# Altium project MS1-SEQ.PrjPcb (part 2 of 3)

## Sheet PowerSheet.SchDoc: MS1-SEQ
size A; Author: Paul Miailhe; CompanyName: Mines Space; SheetNumber: 5; SheetTotal: 6
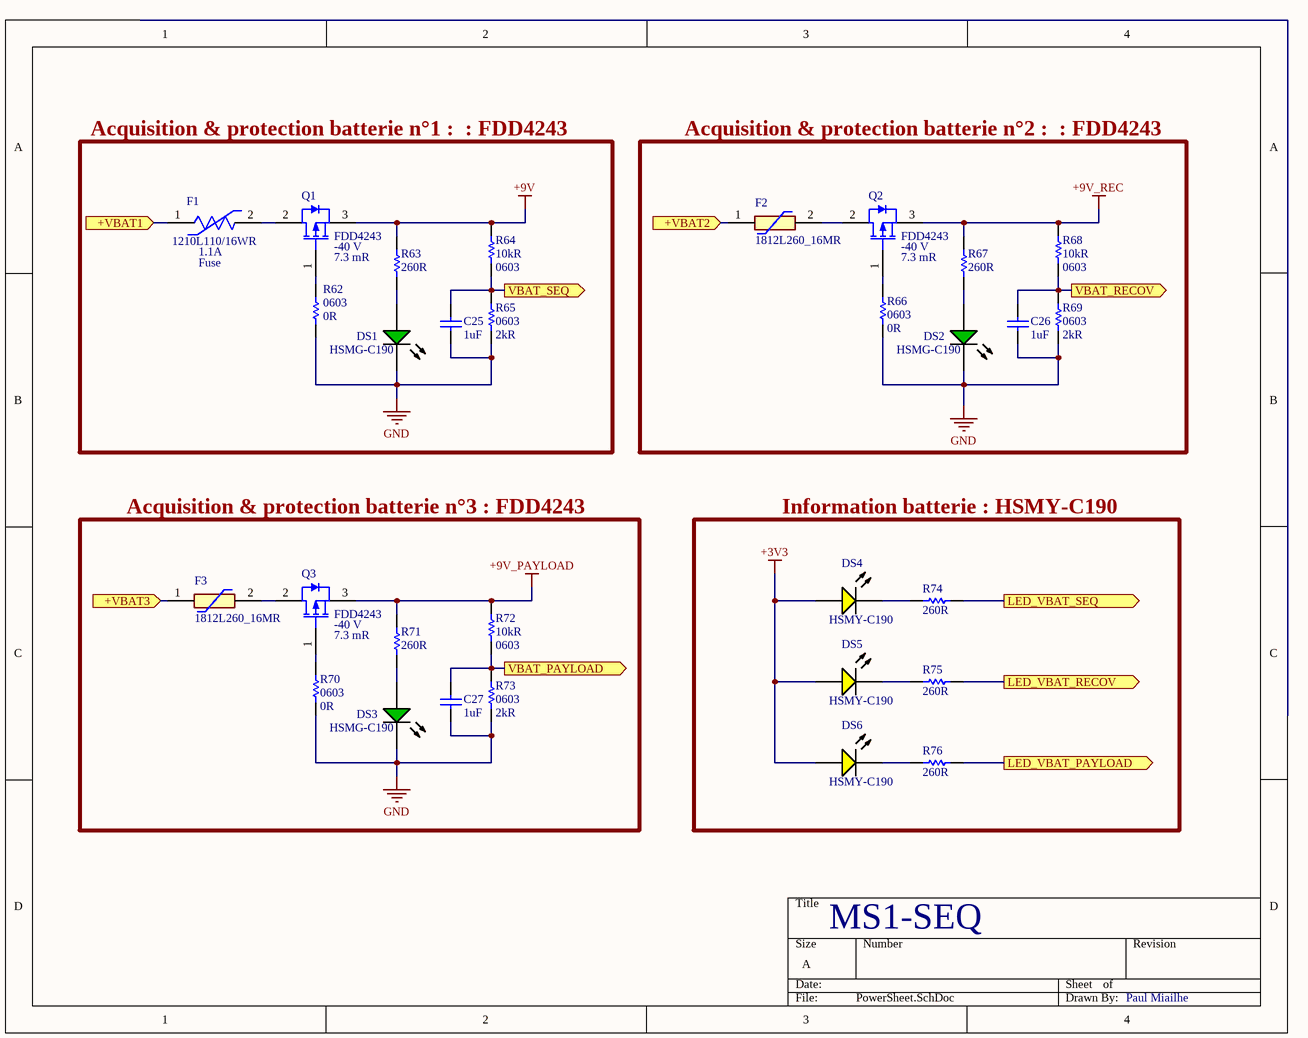
[diagram p2: PowerSheet.SchDoc]

### Parts
C25  Capacitance: 1uF  [CAPC1608X90X35LL10T15]  (hidden comment: GRM188R61E105KA12D)
C26  Capacitance: 1uF  [CAPC1608X90X35LL10T15]  (hidden comment: GRM188R61E105KA12D)
C27  Capacitance: 1uF  [CAPC1608X90X35LL10T15]  (hidden comment: GRM188R61E105KA12D)
DS1  HSMG-C190  [AVAG-HSMX-C190_V]
DS2  HSMG-C190  [AVAG-HSMX-C190_V]
DS3  HSMG-C190  [AVAG-HSMX-C190_V]
DS4  HSMY-C190  [AVAG-HSMX-C190_V]
DS5  HSMY-C190  [AVAG-HSMX-C190_V]
DS6  HSMY-C190  [AVAG-HSMX-C190_V]
F1  1210L110/16WR  Hold Current: 1.1A  Category: Fuse  [FP-1210L110-16WR-MFG]
F2  1812L260_16MR  [1812L010DR]
F3  1812L260_16MR  [1812L010DR]
Q1  FDD4243  VDS (max): -40 V  RDS (on) (max) (@10V): 7.3 mR  [INF-PG-TO252-3-313_L]
Q2  FDD4243  VDS (max): -40 V  RDS (on) (max) (@10V): 7.3 mR  [INF-PG-TO252-3-313_L]
Q3  FDD4243  VDS (max): -40 V  RDS (on) (max) (@10V): 7.3 mR  [INF-PG-TO252-3-313_L]
R62  Package Reference: 0603  Resistance: 0R  [RESC1608X55X25ML10T15]  (hidden comment: RC0603JR-070RL)
R63  260R  [RESC1609X50X30NL8T20]  (no BOM)
R64  Resistance: 10kR  Case Code (Imperial): 0603  [RESC1609X55X30LL15T15]  (hidden comment: ERJ3EKF1002V)
R65  Case Code (Imperial): 0603  Resistance: 2kR  [RESC1608X55X30ML15T15]  (hidden comment: ERJ-3EKF2001V)
R66  Case Code (Imperial): 0603  Resistance: 0R  [RESC1608X55X25ML10T15]  (hidden comment: RC0603JR-070RL)
R67  260R  [RESC1609X50X30NL8T20]  (no BOM)
R68  Resistance: 10kR  Case Code (Imperial): 0603  [RESC1609X55X30LL15T15]  (hidden comment: ERJ3EKF1002V)
R69  Case Code (Imperial): 0603  Resistance: 2kR  [RESC1608X55X30ML15T15]  (hidden comment: ERJ-3EKF2001V)
R70  Case Code (Imperial): 0603  Resistance: 0R  [RESC1608X55X25ML10T15]  (hidden comment: RC0603JR-070RL)
R71  260R  [RESC1609X50X30NL8T20]  (no BOM)
R72  Resistance: 10kR  Case Code (Imperial): 0603  [RESC1609X55X30LL15T15]  (hidden comment: ERJ3EKF1002V)
R73  Case Code (Imperial): 0603  Resistance: 2kR  [RESC1608X55X30ML15T15]  (hidden comment: ERJ-3EKF2001V)
R74  260R  [RESC1609X50X30NL8T20]  (no BOM)
R75  260R  [RESC1609X50X30NL8T20]  (no BOM)
R76  260R  [RESC1609X50X30NL8T20]  (no BOM)

### Blocks framed on the sheet
Acquisition & protection batterie n°1 :  : FDD4243: C25 DS1 F1 Q1 R62-R65
Acquisition & protection batterie n°2 :  : FDD4243: C26 DS2 F2 Q2 R66-R69
Acquisition & protection batterie n°3 : FDD4243: C27 DS3 F3 Q3 R70-R73
Information batterie : HSMY-C190: DS4-DS6 R74-R76

### Ports
+VBAT1 (in), +VBAT2 (in), +VBAT3 (in), LED_VBAT_PAYLOAD (out), LED_VBAT_RECOV (out), LED_VBAT_SEQ (out), VBAT_PAYLOAD (out), VBAT_RECOV (out), VBAT_SEQ (out)

### Nets
+3V3: DS4.1(A) DS5.1(A) DS6.1(A)
+9V: Q1.3(SOURCE) R63.1 R64.2
+9V_PAYLOAD: Q3.3(SOURCE) R71.1 R72.2
+9V_REC: Q2.3(SOURCE) R67.1 R68.2
GND: C25.1 C26.1 C27.1 DS1.2(K) DS2.2(K) DS3.2(K) R62.1 R65.1 R66.1 R69.1 R70.1 R73.1
NetC25_2: C25.2 R64.1 R65.2 ; port VBAT_SEQ
NetC26_2: C26.2 R68.1 R69.2 ; port VBAT_RECOV
NetC27_2: C27.2 R72.1 R73.2 ; port VBAT_PAYLOAD
NetDS1_1: DS1.1(A) R63.2
NetDS2_1: DS2.1(A) R67.2
NetDS3_1: DS3.1(A) R71.2
NetDS4_2: DS4.2(K) R74.1
NetDS5_2: DS5.2(K) R75.1
NetDS6_2: DS6.2(K) R76.1
NetF1_1: F1.1 ; port +VBAT1
NetF1_2: F1.2 Q1.2(DRAIN)
NetF2_1: F2.1 ; port +VBAT2
NetF2_2: F2.2 Q2.2(DRAIN)
NetF3_1: F3.1 ; port +VBAT3
NetF3_2: F3.2 Q3.2(DRAIN)
NetJ101_35: R75.2 ; port LED_VBAT_RECOV
NetJ101_36: R74.2 ; port LED_VBAT_SEQ
NetJ101_37: R76.2 ; port LED_VBAT_PAYLOAD
NetQ1_1: Q1.1(GATE) R62.2
NetQ2_1: Q2.1(GATE) R66.2
NetQ3_1: Q3.1(GATE) R70.2

### Notes on the sheet
- MS1-SEQ
- Paul Miailhe

### Library data of the parts
C25-C27 = CMP-2006-02459-1: Manufacturer: Murata; Material: Ceramic; Tolerance: 10%; Voltage Rating: 25V; Dielectric: X5R; Part Number: GRM188R61E105KA12D; Supplier 1: Farnell; Supplier Part Number 1: 1828802; Manufacturer Part Number: GRM188R61E105KA12D; RoHS: Yes; Category: Ceramic Capacitors; Pricing 1: 10=0.13400, 100=0.05920, 500=0.03800, 1000=0.03090 (GBP); Mount: Surface Mount; Case/Package: 0603; Number of Pins: 2; Case Code (Metric): 1608; Case Code (Imperial): 0603; Min Operating Temperature: -55°C; Max Operating Temperature: 85°C; Packaging: Tape and Reel; Package Quantity: 4000; Voltage Rating (DC): 25V; Termination: SMD/SMT; Voltage: 25V; Length: 1.6mm; Width: 0.031inch; Height: 0.8mm; Depth: 0.8mm; Thickness: 0.035inch; Radiation Hardening: No; RoHS Compliant: Yes; REACH SVHC: No SVHC; Lead Free: Lead Free
DS1-DS3 = CMP-1744-00002-1: Chip LED, Green, 2.2 V, -40 to 85 degC, 2-Pin SMD, RoHS, Tape and Reel; Frequency: 400 KHz; Max Supply Voltage: 5.5 V; Access Time: 3500 ns; Clock Frequency: 100 KHz; Case\Package: SOIC; Density: 32 kb; Nominal Supply Current: 2 mA; Interface: Serial; Min Supply Voltage: 1.7 V; Packaging: Tape and Reel; PackageReference: HSMX-C190; ComponentLink2URL: http://docs.avagotech.com/docs/AV02-0551EN; RoHSCompliant: true; Pins: 8; REACH SVHC: No SVHC; Max Operating Temperature: 85 degC; Width: 4 mm; Radiation Hardening: No; Package Quantity: 3000; ComponentLink3Description: Package Specification; ComponentLink1Description: Manufacturer URL; Min Operating Temperature: -40 degC; PackageDescription: 2-Pin Surface Mount Device, Body 1.6 x 0.8 mm, Height 0.9 mm; Max Clock Frequency: 100 KHz; Height: 1.5 mm; ComponentLink1URL: http://www.avagotech.com/; DatasheetVersion: Mar-12; ComponentLink2Description: Datasheet; Mount: Surface Mount; Length: 5 mm; ComponentLink3URL: http://www.fairchildsemi.com/dwg/MA/MA03D.pdf
DS4-DS6 = CMP-1744-00003-1: LED Uni-Color Yellow, 65 mW, 20 mA, -40 to 85 degC, 2-Pin SMD, RoHS, Tape and Reel; Tolerance: 1%; Voltage Rating: 50 V; Power Rating: 100 mW; Case\Package: 0603; Resistance: 390 Ohm; Min Operating Temperature: -55 degC; Length: 1.6 mm; ComponentLink3Description: Package Specification; Mount: Surface Mount; PackageReference: HSMX-C190; ComponentLink2Description: Datasheet; DatasheetVersion: Mar-12; Case Code (Metric): 1608; Pins: 2; Package Quantity: 5000; ComponentLink2URL: http://docs.avagotech.com/docs/AV02-0551EN; ComponentLink1Description: Manufacturer URL; RoHSCompliant: true; Packaging: Tape and Reel; PackageDescription: 2-Pin Surface Mount Device, Body 1.6 x 0.8 mm, Height 0.9 mm; REACH SVHC: No SVHC; ComponentLink3URL: http://www.fairchildsemi.com/dwg/MA/MA03D.pdf; Voltage Rating (DC): 50 V; Width: 0.8 mm; ComponentLink1URL: http://www.avagotech.com/; Max Operating Temperature: 155 degC; Case Code (Imperial): 0603; Height: 0.45 mm
F1 = CMP-08606-000029-1: PTC RESET FUSE 16V 1.1A 1210; Manufacturer: Littelfuse Inc; Trip Time: 0.1s; Value: 0.06-0.21Ω; Trip Current: 2.2A; Current Rating: 100A; Ambient Temperature Range Low: -40°C; Voltage Rating: 16V; ComponentLink2URL: https://www.littelfuse.com/~/media/electronics/datasheets/resettable_ptcs/littelfuse_ptc_1210l_datasheet.pdf.pdf; Device Class L2: PTC Resettable Fuses; Automotive: No; Temperature: -40°C to +85°C; Mouser Description: Resettable Fuses - PPTC 16V 1.10A 1210 PTC; Temperature Range High: +85°C; Manufacturer Part Number: 1210L110/16WR; Temperature Range Low: -40°C; Device Class L1: Circuit Protection; Octopart: https://octopart.com/1210l110%2F16wr-littelfuse-28867107; Lead Free: Yes; Resistance: 0.06-0.21Ω; RoHS: TRUE; Digikey Description: PTC RESET FUSE 16V 1.1A 1210; Package: 0; Height: 1.25mm; Device Class L3: unset; ComponentLink2Description: Datasheet; Ambient Temperature Range High: +85°C
F2 F3 = 1812L260_16MR: Resettable Fuse; Manufacturer_Name: LITTELFUSE; Manufacturer_Part_Number: 1812L260/16MR; Datasheet Link: http://www.littelfuse.com/~/media/electronics/datasheets/resettable_ptcs/littelfuse_ptc_1812l_datasheet.pdf.pdf; Height: 1.25mm; Mouser Part Number: 576-1812L260/16MR; Mouser Price/Stock: https://www.mouser.co.uk/ProductDetail/Littelfuse/1812L260-16MR?qs=cIziFXvMxOVeszNO%252BSt%252B3Q%3D%3D; Arrow Part Number: 1812L260/16MR; Arrow Price/Stock: https://www.arrow.com/en/products/1812l26016mr/littelfuse
Q1-Q3 = CMP-1138-00157-1: OptiMOS-P2 Power-Transistor, -40 V VDS, -85 A ID, PG-TO252-3-313, Reel, Green; PartNumber: IPD85P04P4-07; Manufacturer: Infineon; Ptot (max): 88 W; RthJC (max): 1.7 K/W; VGS(th) (max): -4 V; IDpuls (max): -340 A; VGS(th) (min): -2 V; ID (max): -85 A; QG: 69 nC; Green: TRUE; Mounting Technology: Surface Mount; Technology: OptiMOS-P2; ComponentLink1URL: http://www.infineon.com/; DatasheetVersion: Rev. 1.0; PackageReference: PG-TO252-3-313; ComponentLink2Description: Datasheet; ComponentLink2URL: http://www.infineon.com/dgdl/IPD85P04P4-07_DS_10.pdf?folderId=db3a304412b407950112b42b75b74520&fileId=db3a30432f69f146012f782666e92ddd&location=en.Products.Automotive_ICs.Automotive_MOSFETs.Single__P-Channel_40V_MOSFETs.DATASHEET.IPD85P04P4-07_DS_10.pdf; Halogen-free: TRUE; ComponentLink3Description: Package Specification; Packing: Reel; PackageVersion: Oct-10; PackageDescription: 3-Pin Plastic (Green) Transistor Single Outline Package, 6.5 x 6.12 mm Body, 2.28 mm Pitch; ComponentLink3URL: http://www.infineon.com/dgdl/PG-TO252-3-313-Package_Overview.pdf?folderId=db3a30432b57a660012b81890ade72d2&fileId=db3a30432b57a660012b8193af2872eb; ComponentLink1Description: Manufacturer URL
R62 R66 R70 = CMP-2100-03667-1: Chip Resistor, 0 Ohm, +/- 5%, 0.1 W, -55 to 155 degC, 0603 (1608 Metric), RoHS, Tape and Reel; Manufacturer: Yageo; Temperature Coefficient: 200ppm/degreesC; Voltage Rating: 50V; Power Rating: 100mW; Width: 0.8mm; Max Operating Temperature: 155degC; Tolerance: 5%; Height: 0.45mm; Depth: 0.8mm; Package Description: 2-Pin Surface Mount Device, Body 1.6 x 0.8 mm; Termination: SMD/SMT; Package Quantity: 5000; Case/Package: 0603; Radiation Hardening: No; Number of Pins: 2; Length: 1.6mm; Lead Free: LeadFree; Voltage Rating (DC): 50V; Military Standard: Not; Datasheet URL: http://www.yageo.com/NewPortal/yageodocoutput?fileName=/pdf/R-Chip/PYu-RC_Group_51_RoHS_L_5.pdf; Manufacturer URL: http://www.yageo.com/; Packaging: TapeandReel; Case Code (Metric): 1608; Min Operating Temperature: -55degC; Composition: ThickFilm; RoHSCompliant: true; Contact Plating: Tin; Datasheet Version: Rev. 5, 10/2016; REACH SVHC: NoSVHC; Supplier 1: Mouser; Supplier Part Number 1: 603-RC0603JR-070RL; Manufacturer Part Number: RC0603JR-070RL; RoHS: Yes; Category: Chip SMD Resistors; Stock 1: 968392; Pricing 1: 1=0,10000, 10=0,01000, 50=0,01000, 100=0,00500, 1000=0,00400, 5000=0,00200, 10000=0,00200 (USD); Size Code: 0603; Resistor Type: Thick Film; Features: Moisture Resistant; Series: RC; Max Power Dissipation: 100mW; Number of Terminations: 2; Construction: Rectangular; Technology: THICK FILM; Resistance Tolerance: 5%; RoHS Compliant: Yes; ComponentLink1URL: https://datasheet.ciiva.com/11808/pyu-r-int-6-11808700.pdf?src-supplier=RSComponents; ComponentLink1Description: https://datasheet.ciiva.com/11808/pyu-r-int-6-11808700.pdf?src-supplier=RSComponents; ComponentLink2URL: https://datasheet.ciiva.com/22747/443971-22747530.pdf?src-supplier=Element14; ComponentLink2Description: https://datasheet.ciiva.com/22747/443971-22747530.pdf?src-supplier=Element14; ComponentLink3URL: https://datasheet.ciiva.com/12555/rc0603-272842-12555254.pdf?src-supplier=Mouser; ComponentLink3Description: https://datasheet.ciiva.com/12555/rc0603-272842-12555254.pdf?src-supplier=Mouser; ComponentLink4URL: https://datasheet.ciiva.com/7746/1738695-7746421.pdf?src-supplier=Element14; ComponentLink4Description: https://datasheet.ciiva.com/7746/1738695-7746421.pdf?src-supplier=Element14; ComponentLink5URL: https://datasheet.ciiva.com/7746/1738695-7746422.pdf?src-supplier=Element14; ComponentLink5Description: https://datasheet.ciiva.com/7746/1738695-7746422.pdf?src-supplier=Element14; ComponentLink6URL: https://datasheet.ciiva.com/8883/pyu-rc0603-51-rohs-l-4-8883045.pdf?src-supplier=Avnet; ComponentLink6Description: https://datasheet.ciiva.com/8883/pyu-rc0603-51-rohs-l-4-8883045.pdf?src-supplier=Avnet; ComponentLink7URL: https://datasheet.ciiva.com/15189/getdatasheetpartid-329462-15189845.pdf?src-supplier=Verical; ComponentLink7Description: https://datasheet.ciiva.com/15189/getdatasheetpartid-329462-15189845.pdf?src-supplier=Verical
  R66 R70: Package Reference: 0603
R63 R67 R71 R74-R76 = CMP-2000-03816-5: Manufacturer: Vishay Semiconductor; Voltage Rating: 75 V; Package Quantity: 5000; DatasheetVersion: 06/2012; Min Operating Temperature: -55 degC; ComponentLink1URL: http://www.vishay.com/; Mounting Technology: Surface Mount; Height: 0.45 mm; ComponentLink1Description: Manufacturer URL; REACH SVHC: Unknown; PackageReference: 0603; Packaging: Tape and Reel; Max Operating Temperature: 155 degC; Mount: Surface Mount; ComponentLink2Description: Datasheet; PackageDescription: 2-Pin Surface Mount Device, Body 1.575 x 0.85 mm; Length: 1.55 mm; ComponentLink2URL: http://www.vishay.com/docs/20035/dcrcwe3.pdf; Pins: 2; RoHSCompliant: true
R64 R68 R72 = CMP-1012-00623-3: Chip Resistor, 10 KOhm, +/- 1%, 0.1 W, -55 to 155 degC, 0603 (1608 Metric), RoHS, Tape and Reel; Manufacturer: Panasonic; Manufacturer Part Number: ERJ-3EKF1002V; Voltage Rating: 75V; Power Rating: 100mW; Temperature Coefficient: 100ppm\/degreesC; Case\/Package: 0603; Number of Pins: 2; Package Reference: 603; Depth: 0.8mm; Mount: SurfaceMount; Package Description: 2-Pin Surface Mount Device, Body 1.6 x 0.85 mm; Datasheet Version: 02/2017; Length: 1.6mm; Lead Free: LeadFree; Height: 0.45mm; Number of Terminations: 2; Max Power Dissipation: 100mW; Min Operating Temperature: -55degC; Datasheet URL: https://industrial.panasonic.com/cdbs/www-data/pdf/RDA0000/AOA0000C304.pdf; Termination: SMD/SMT; Case Code (Metric): 1608; Tolerance: 1%; Max Operating Temperature: 155degC; RoHSCompliant: true; Voltage Rating (DC): 75V; Radiation Hardening: No; Packaging: TapeandReel; Composition: ThickFilm; Mounting Technology: SurfaceMount; Manufacturer URL: http://www.panasonic.com/; Width: 0.031inch; REACH SVHC: NoSVHC; Contact Plating: Tin; Military Standard: Not; Package Quantity: 1; Supplier 1: Mouser; Supplier Part Number 1: 667-ERJ-3EKF1002V; RoHS: Yes; Category: Chip SMD Resistors; Stock 1: 20455; Pricing 1: 1=0,10000, 10=0,04000, 50=0,04000, 100=0,01700, 1000=0,00700, 5000=0,00500, 10000=0,00500 (USD); Case/Package: 0603; Size Code: 0603; Resistor Type: Thick Film; Series: ERJ; Resistance Tolerance: 1%; Construction: Rectangular; Features: Automotive AEC-Q200; Technology: THICK FILM; RoHS Compliant: Yes; ComponentLink1URL: https://datasheet.ciiva.com/16511/aoa0000ce2-16511861.pdf?src-supplier=Avnet+Asia; ComponentLink1Description: https://datasheet.ciiva.com/16511/aoa0000ce2-16511861.pdf?src-supplier=Avnet+Asia; ComponentLink2URL: https://datasheet.ciiva.com/46372/1678782-46372725.pdf?src-supplier=Element14; ComponentLink2Description: https://datasheet.ciiva.com/46372/1678782-46372725.pdf?src-supplier=Element14; ComponentLink3URL: https://datasheet.ciiva.com/28514/426256-28514198.pdf?src-supplier=Element14; ComponentLink3Description: https://datasheet.ciiva.com/28514/426256-28514198.pdf?src-supplier=Element14; ComponentLink4URL: https://datasheet.ciiva.com/9194/aoa0000ce2-9194199.pdf?src-supplier=Avnet; ComponentLink4Description: https://datasheet.ciiva.com/9194/aoa0000ce2-9194199.pdf?src-supplier=Avnet; ComponentLink5URL: https://datasheet.ciiva.com/7830/aoa0000ce2-7830729.pdf?src-supplier=Element14; ComponentLink5Description: https://datasheet.ciiva.com/7830/aoa0000ce2-7830729.pdf?src-supplier=Element14; ComponentLink6URL: https://datasheet.ciiva.com/17212/aoa0000ce2-17212105.pdf?src-supplier=Avnet+Europe; ComponentLink6Description: https://datasheet.ciiva.com/17212/aoa0000ce2-17212105.pdf?src-supplier=Avnet+Europe; ComponentLink7URL: https://datasheet.ciiva.com/30208/aoa0000ce2-30208985.pdf?src-supplier=Onlinecomponents.com; ComponentLink7Description: https://datasheet.ciiva.com/30208/aoa0000ce2-30208985.pdf?src-supplier=Onlinecomponents.com; ComponentLink8URL: https://datasheet.ciiva.com/48530/aoa0000ce2-48530988.pdf?src-supplier=Avnet; ComponentLink8Description: https://datasheet.ciiva.com/48530/aoa0000ce2-48530988.pdf?src-supplier=Avnet; ComponentLink9URL: https://datasheet.ciiva.com/24070/aoa0000ce2-24070318.pdf?src-supplier=Mouser; ComponentLink9Description: https://datasheet.ciiva.com/24070/aoa0000ce2-24070318.pdf?src-supplier=Mouser; ComponentLink10URL: https://datasheet.ciiva.com/16759/70260748-16759807.pdf?src-supplier=Allied+Electronics; ComponentLink10Description: https://datasheet.ciiva.com/16759/70260748-16759807.pdf?src-supplier=Allied+Electronics
R65 R69 R73 = CMP-2000-00317-1: Manufacturer: Panasonic; Power Rating: 100mW; Tolerance: 1%; Voltage Rating: 75V; Temperature Coefficient: 100ppm/°C; Voltage Rating (DC): 50V; Part Number: ERJ-3EKF2001V; Supplier 1: Mouser; Supplier Part Number 1: 667-ERJ-3EKF2001V; Manufacturer Part Number: ERJ-3EKF2001V; RoHS: Yes; Category: Chip SMD Resistors; Stock 1: 44455; Pricing 1: 1=0,10000, 10=0,03200, 50=0,03200, 100=0,01500, 1000=0,00700, 10000=0,00400 (USD); Mount: Surface Mount; Case/Package: 0603; Case Code (Metric): 1608; Contact Plating: Tin; Size Code: 0603; Min Operating Temperature: -55°C; Max Operating Temperature: 155°C; Packaging: Tape and Reel; Package Quantity: 1; Resistor Type: Thick Film; Number of Terminations: 2; Termination: SMD/SMT; Max Power Dissipation: 100mW; Series: ERJ; Resistance Tolerance: 1%; Construction: Rectangular; Features: Automotive AEC-Q200; Length: 1.6mm; Width: 0.031inch; Height: 0.022inch; Depth: 0.8mm; Radiation Hardening: No; REACH SVHC: No SVHC; Military Standard: Not; Lead Free: Lead Free; RoHS Compliant: Yes; ComponentLink1URL: https://datasheet.ciiva.com/43460/1678782-43460485.pdf?src-supplier=Farnell; ComponentLink1Description: https://datasheet.ciiva.com/43460/1678782-43460485.pdf?src-supplier=Farnell; ComponentLink2URL: https://datasheet.ciiva.com/6082/1678782-6082059.pdf?src-supplier=Farnell; ComponentLink2Description: https://datasheet.ciiva.com/6082/1678782-6082059.pdf?src-supplier=Farnell; ComponentLink3URL: https://datasheet.ciiva.com/46377/1678782-46377366.pdf?src-supplier=Element14; ComponentLink3Description: https://datasheet.ciiva.com/46377/1678782-46377366.pdf?src-supplier=Element14; ComponentLink4URL: https://datasheet.ciiva.com/28673/1678782-28673990.pdf?src-supplier=Element14; ComponentLink4Description: https://datasheet.ciiva.com/28673/1678782-28673990.pdf?src-supplier=Element14; ComponentLink5URL: https://datasheet.ciiva.com/24027/aoa0000ce2-24027453.pdf?src-supplier=Mouser; ComponentLink5Description: https://datasheet.ciiva.com/24027/aoa0000ce2-24027453.pdf?src-supplier=Mouser; ComponentLink6URL: https://datasheet.ciiva.com/16771/70260748-16771369.pdf?src-supplier=Allied+Electronics; ComponentLink6Description: https://datasheet.ciiva.com/16771/70260748-16771369.pdf?src-supplier=Allied+Electronics; ComponentLink7URL: https://datasheet.ciiva.com/16200/aoa0000ce2-16200501.pdf?src-supplier=Future+Electronics; ComponentLink7Description: https://datasheet.ciiva.com/16200/aoa0000ce2-16200501.pdf?src-supplier=Future+Electronics; ComponentLink8URL: https://datasheet.ciiva.com/30064/aoa0000ce2-30064920.pdf?src-supplier=Onlinecomponents.com; ComponentLink8Description: https://datasheet.ciiva.com/30064/aoa0000ce2-30064920.pdf?src-supplier=Onlinecomponents.com; ComponentLink9URL: https://datasheet.ciiva.com/17214/aoa0000ce2-17214393.pdf?src-supplier=Avnet+Europe; ComponentLink9Description: https://datasheet.ciiva.com/17214/aoa0000ce2-17214393.pdf?src-supplier=Avnet+Europe

## Sheet NucleoSheet.SchDoc
size A; SheetNumber: 6; SheetTotal: 6
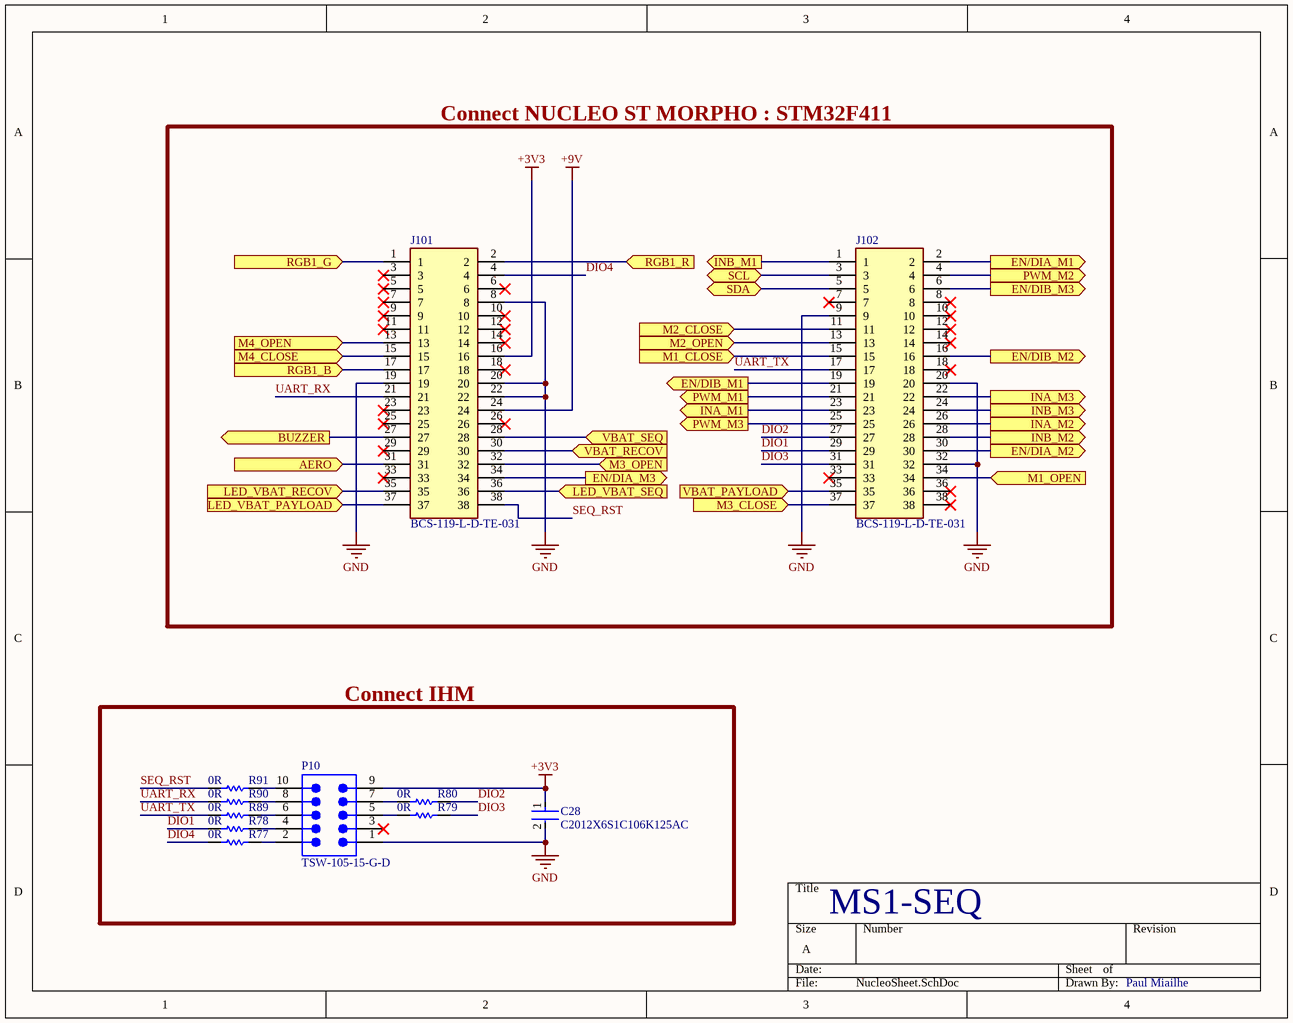
[diagram p3: NucleoSheet.SchDoc]

### Parts
C28  C2012X6S1C106K125AC  [FP-C2012-125-0_2-MFG]
J101  BCS-119-L-D-TE-031  [RHDR38W51P254_2X19_4826X508X737P]
J102  BCS-119-L-D-TE-031  [RHDR38W51P254_2X19_4826X508X737P]
P10  TSW-105-15-G-D  [SMTC-TSW-105-15-X-D]
R77  Resistor: 0R  [RESC1609X50X30NL8T20]  (hidden comment: CRCW06030000Z0EA)
R78  Resistor: 0R  [RESC1609X50X30NL8T20]  (hidden comment: CRCW06030000Z0EA)
R79  Resistor: 0R  [RESC1609X50X30NL8T20]  (hidden comment: CRCW06030000Z0EA)
R80  Resistor: 0R  [RESC1609X50X30NL8T20]  (hidden comment: CRCW06030000Z0EA)
R89  Resistor: 0R  [RESC1609X50X30NL8T20]  (hidden comment: CRCW06030000Z0EA)
R90  Resistor: 0R  [RESC1609X50X30NL8T20]  (hidden comment: CRCW06030000Z0EA)
R91  Resistor: 0R  [RESC1609X50X30NL8T20]  (hidden comment: CRCW06030000Z0EA)

### Blocks framed on the sheet
Connect NUCLEO ST MORPHO : STM32F411: J101 J102
Connect IHM: C28 P10 R77-R80 R89-R91

### Ports
AERO (in), BUZZER (out), EN/DIA_M1 (out), EN/DIA_M2 (out), EN/DIA_M3 (out), EN/DIB_M1 (out), EN/DIB_M2 (out), EN/DIB_M3 (out), INA_M1 (out), INA_M2 (out), INA_M3 (out), INB_M1 (out), INB_M2 (out), INB_M3 (out), LED_VBAT_PAYLOAD (in), LED_VBAT_RECOV (in), LED_VBAT_SEQ (in), M1_CLOSE (in), M1_OPEN (in), M2_CLOSE (in), M2_OPEN (in), M3_CLOSE (in), M3_OPEN (in), M4_CLOSE (in), M4_OPEN (in), PWM_M1 (out), PWM_M2 (out), PWM_M3 (out), RGB1_B (in), RGB1_G (in), RGB1_R (in), SCL (bidir), SDA (bidir), VBAT_PAYLOAD (in), VBAT_RECOV (in), VBAT_SEQ (in)

### Nets
+3V3: C28.1 J101.16 P10.9
+9V: J101.24
GND: C28.2 J101.8 J101.19 J101.20 J101.22 J102.9 J102.20 J102.32 P10.1
DIO1: J102.29 R78.1
DIO2: J102.27 R80.2
DIO3: J102.31 R79.2
DIO4: J101.4 R77.1
SCL: J102.3 ; port SCL
SDA: J102.5 ; port SDA
SEQ_RST: J101.38 R91.1
UART_RX: J101.21 R90.1
UART_TX: J102.17 R89.1
NetC25_2: J101.28 ; port VBAT_SEQ
NetC26_2: J101.30 ; port VBAT_RECOV
NetC27_2: J102.35 ; port VBAT_PAYLOAD
NetJ101_1: J101.1 ; port RGB1_G
NetJ101_2: J101.2 ; port RGB1_R
NetJ101_13: J101.13 ; port M4_OPEN
NetJ101_15: J101.15 ; port M4_CLOSE
NetJ101_17: J101.17 ; port RGB1_B
NetJ101_27: J101.27 ; port BUZZER
NetJ101_31: J101.31 ; port AERO
NetJ101_32: J101.32 ; port M3_OPEN
NetJ101_34: J101.34 ; port EN/DIA_M3
NetJ101_35: J101.35 ; port LED_VBAT_RECOV
NetJ101_36: J101.36 ; port LED_VBAT_SEQ
NetJ101_37: J101.37 ; port LED_VBAT_PAYLOAD
NetJ102_1: J102.1 ; port INB_M1
NetJ102_2: J102.2 ; port EN/DIA_M1
NetJ102_4: J102.4 ; port PWM_M2
NetJ102_6: J102.6 ; port EN/DIB_M3
NetJ102_11: J102.11 ; port M2_CLOSE
NetJ102_13: J102.13 ; port M2_OPEN
NetJ102_15: J102.15 ; port M1_CLOSE
NetJ102_16: J102.16 ; port EN/DIB_M2
NetJ102_19: J102.19 ; port EN/DIB_M1
NetJ102_21: J102.21 ; port PWM_M1
NetJ102_22: J102.22 ; port INA_M3
NetJ102_23: J102.23 ; port INA_M1
NetJ102_24: J102.24 ; port INB_M3
NetJ102_25: J102.25 ; port PWM_M3
NetJ102_26: J102.26 ; port INA_M2
NetJ102_28: J102.28 ; port INB_M2
NetJ102_30: J102.30 ; port EN/DIA_M2
NetJ102_34: J102.34 ; port M1_OPEN
NetJ102_37: J102.37 ; port M3_CLOSE
NetP10_2: P10.2 R77.2
NetP10_4: P10.4 R78.2
NetP10_5: P10.5 R79.1
NetP10_6: P10.6 R89.2
NetP10_7: P10.7 R80.1
NetP10_8: P10.8 R90.2
NetP10_10: P10.10 R91.2

Not connected (* = marked no-connect by the designer): J101 3* 5* 6* 7* 9* 10* 11* 12* 14* 18* 23* 25* 26* 29* 33*; J102 7* 8* 10* 12* 14* 18* 33* 36* 38*; P10 3*

### Notes on the sheet
- MS1-SEQ
- Paul Miailhe

### Library data of the parts
C28 = CMP-08246-003655-1: Multilayer Ceramic Capacitors 10μF ±10% 16V X6S SMD 0805; Capacitance: 10uF; Contact Plating: Tin; Height: 1.25mm; Thickness: 0.057inch; Case Code (Metric): 2012; Dielectric Material: Ceramic; Tolerance: 10%; Depth: 1.25mm; Length: 2mm; Lead Free: Lead Free; RoHS Compliant: Yes; Case/Package: 0805; REACH SVHC: No SVHC; Construction: Flat; Voltage Rating: 16V; Max Operating Temperature: 105°C; Series: C; Width: 0.049inch; Voltage Rating (DC): 16V; Packaging: Tape and Reel; Package Quantity: 1; Min Operating Temperature: -55°C; Mount: Surface Mount; Dielectric: X6S; Case Code (Imperial): 0805
J101 J102 = BCS-119-L-D-TE-031: Connector; Manufacturer_Name: SAMTEC; Datasheet Link: https://www.mouser.de/datasheet/2/527/bcs-1316906.pdf; Height: 7.37mm; Manufacturer_Part_Number: BCS-119-L-D-TE-031; Mouser Part Number: N/A; Mouser Price/Stock: https://www.mouser.co.uk/ProductDetail/Samtec/BCS-119-L-D-TE-031?qs=PZi7%2FduGOzQePdTvRHH2MQ%3D%3D
P10 = CMP-1024-00369-1: 0.025" SQ Post Header, Through-hole, Vertical, -55 to 125 degC, 2.54 mm Pitch, 10-Pin, Male, RoHS; Manufacturer: Samtec; Pitch: 2.54 mm; ComponentLink2Description: Datasheet; ComponentLink1URL: http://www.samtec.com; DatasheetVersion: F-214; ComponentLink3Description: Package Specification; PartNumber: TSW-105-15-G-D; RoHS: True; Temperature Range: -55 to 125 degC; ComponentLink3URL: http://www.samtec.com/documents/webfiles/cpdf/TSW-XXX-XX-XXX-X-XX-XXX-MKT.pdf; Orientation: Vertical; Mounting Technology: Through-hole; PackageReference: TSW-105-15-X-D; PackageVersion: DM, 8/1988; PackageDescription: .025[0.64] SQ. Post Terminal Strip Assembly; ComponentLink2URL: http://www.samtec.com/documents/webfiles/pdf/TSW_TH.PDF; ComponentLink1Description: Manufacturer URL
R77-R80 R89-R91 = CMP-2000-03816-5: Chip Resistor, 0 Ohm, Jumper, 100 mW, -55 to 155 degC, 0603 (1608 Metric), RoHS, Tape and Reel; Manufacturer: Vishay Semiconductor; Voltage Rating: 75 V; Package Quantity: 5000; DatasheetVersion: 06/2012; Min Operating Temperature: -55 degC; ComponentLink1URL: http://www.vishay.com/; Mounting Technology: Surface Mount; Height: 0.45 mm; ComponentLink1Description: Manufacturer URL; REACH SVHC: Unknown; Packaging: Tape and Reel; Max Operating Temperature: 155 degC; Mount: Surface Mount; ComponentLink2Description: Datasheet; PackageDescription: 2-Pin Surface Mount Device, Body 1.575 x 0.85 mm; Length: 1.55 mm; ComponentLink2URL: http://www.vishay.com/docs/20035/dcrcwe3.pdf; Pins: 2; RoHSCompliant: true

## Sheet GPIOSheet.SchDoc
size A; SheetNumber: 4; SheetTotal: 6
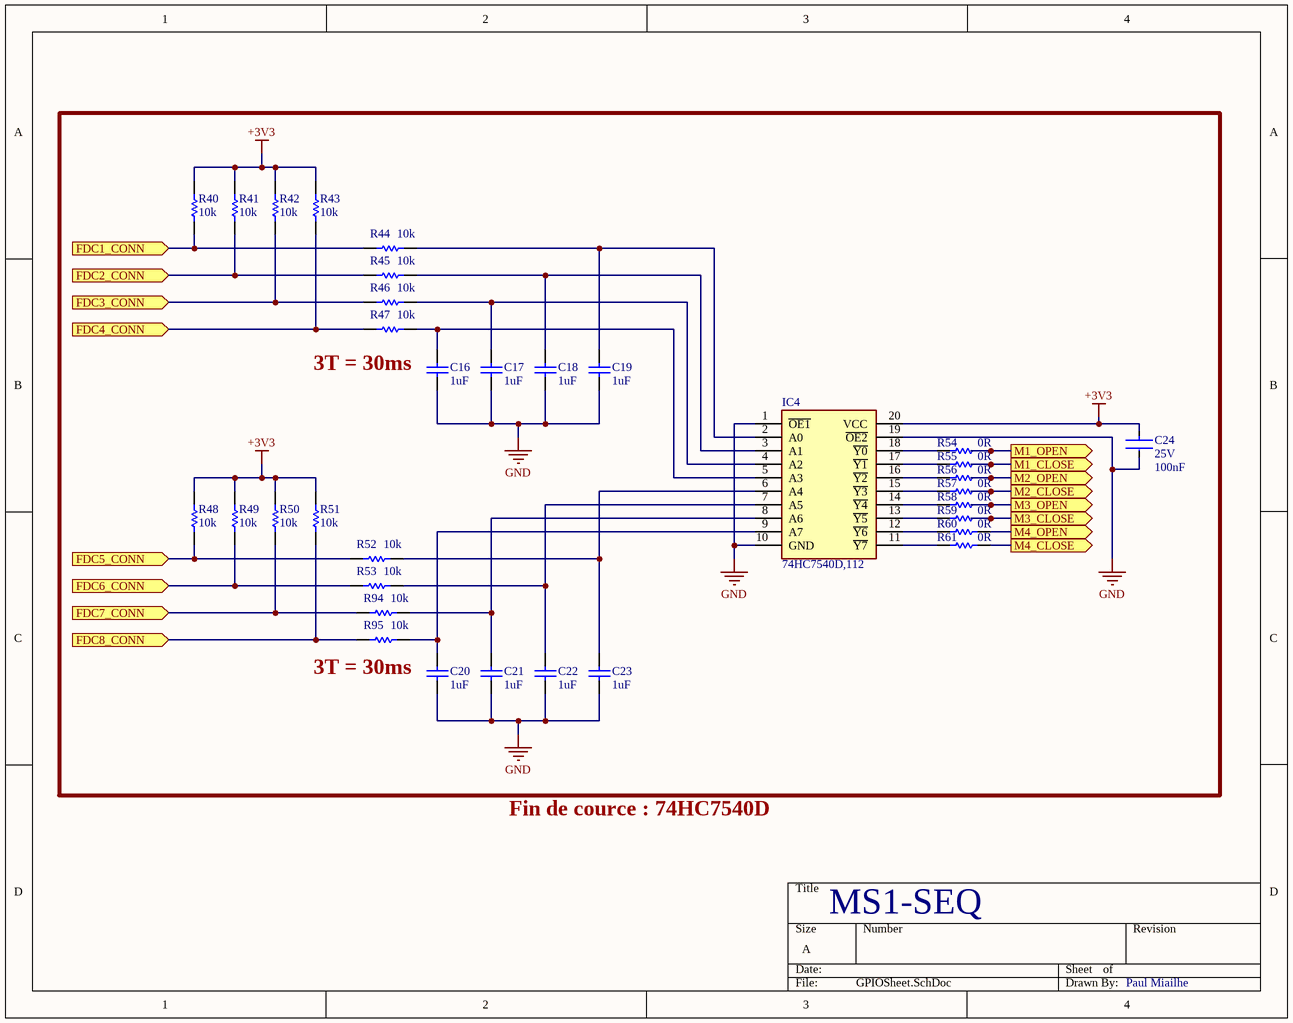
[diagram p4: GPIOSheet.SchDoc]

### Parts
C16  Capacitance: 1uF  [CAPC1608X90X35LL10T15]  (hidden comment: GRM188R61E105KA12D)
C17  Capacitance: 1uF  [CAPC1608X90X35LL10T15]  (hidden comment: GRM188R61E105KA12D)
C18  Capacitance: 1uF  [CAPC1608X90X35LL10T15]  (hidden comment: GRM188R61E105KA12D)
C19  Capacitance: 1uF  [CAPC1608X90X35LL10T15]  (hidden comment: GRM188R61E105KA12D)
C20  Capacitance: 1uF  [CAPC1608X90X35LL10T15]  (hidden comment: GRM188R61E105KA12D)
C21  Capacitance: 1uF  [CAPC1608X90X35LL10T15]  (hidden comment: GRM188R61E105KA12D)
C22  Capacitance: 1uF  [CAPC1608X90X35LL10T15]  (hidden comment: GRM188R61E105KA12D)
C23  Capacitance: 1uF  [CAPC1608X90X35LL10T15]  (hidden comment: GRM188R61E105KA12D)
C24  Voltage Rating (DC): 25V  Capacitance: 100nF  [FP-CGA3E-0_3-0_1-MFG]  (hidden comment: CGA3E2X7R1E104K080AA)
IC4  74HC7540D,112  [SOIC127P1032X265-20N]
R40  Resistance: 10k  [RESC1609X55X30LL15T15]  (hidden comment: ERJ3EKF1002V)
R41  Resistance: 10k  [RESC1609X55X30LL15T15]  (hidden comment: ERJ3EKF1002V)
R42  Resistance: 10k  [RESC1609X55X30LL15T15]  (hidden comment: ERJ3EKF1002V)
R43  Resistance: 10k  [RESC1609X55X30LL15T15]  (hidden comment: ERJ3EKF1002V)
R44  Resistance: 10k  [RESC1609X55X30LL15T15]  (hidden comment: ERJ3EKF1002V)
R45  Resistance: 10k  [RESC1609X55X30LL15T15]  (hidden comment: ERJ3EKF1002V)
R46  Resistance: 10k  [RESC1609X55X30LL15T15]  (hidden comment: ERJ3EKF1002V)
R47  Resistance: 10k  [RESC1609X55X30LL15T15]  (hidden comment: ERJ3EKF1002V)
R48  Resistance: 10k  [RESC1609X55X30LL15T15]  (hidden comment: ERJ3EKF1002V)
R49  Resistance: 10k  [RESC1609X55X30LL15T15]  (hidden comment: ERJ3EKF1002V)
R50  Resistance: 10k  [RESC1609X55X30LL15T15]  (hidden comment: ERJ3EKF1002V)
R51  Resistance: 10k  [RESC1609X55X30LL15T15]  (hidden comment: ERJ3EKF1002V)
R52  Resistance: 10k  [RESC1609X55X30LL15T15]  (hidden comment: ERJ3EKF1002V)
R53  Resistance: 10k  [RESC1609X55X30LL15T15]  (hidden comment: ERJ3EKF1002V)
R54  0R  [RESC1608X55X25ML10T15]
R55  0R  [RESC1608X55X25ML10T15]
R56  0R  [RESC1608X55X25ML10T15]
R57  0R  [RESC1608X55X25ML10T15]
R58  0R  [RESC1608X55X25ML10T15]
R59  0R  [RESC1608X55X25ML10T15]
R60  0R  [RESC1608X55X25ML10T15]
R61  0R  [RESC1608X55X25ML10T15]
R94  Resistance: 10k  [RESC1609X55X30LL15T15]  (hidden comment: ERJ3EKF1002V)
R95  Resistance: 10k  [RESC1609X55X30LL15T15]  (hidden comment: ERJ3EKF1002V)

### Ports
FDC1_CONN (in), FDC2_CONN (in), FDC3_CONN (in), FDC4_CONN (in), FDC5_CONN (in), FDC6_CONN (in), FDC7_CONN (in), FDC8_CONN (in), M1_CLOSE (out), M1_OPEN (out), M2_CLOSE (out), M2_OPEN (out), M3_CLOSE (out), M3_OPEN (out), M4_CLOSE (out), M4_OPEN (out)

### Nets
+3V3: C24.1 IC4.20(VCC) R40.2 R41.2 R42.2 R43.2 R48.2 R49.2 R50.2 R51.2
GND: C16.1 C17.1 C18.1 C19.1 C20.1 C21.1 C22.1 C23.1 C24.2 IC4.1(~{OE1}) IC4.10(GND) IC4.19(~{OE2})
NetC16_2: C16.2 IC4.5(A3) R47.1
NetC17_2: C17.2 IC4.4(A2) R46.1
NetC18_2: C18.2 IC4.3(A1) R45.1
NetC19_2: C19.2 IC4.2(A0) R44.1
NetC20_2: C20.2 IC4.9(A7) R95.1
NetC21_2: C21.2 IC4.8(A6) R94.1
NetC22_2: C22.2 IC4.7(A5) R53.1
NetC23_2: C23.2 IC4.6(A4) R52.1
NetIC4_11: IC4.11(~{Y7}) R61.1
NetIC4_12: IC4.12(~{Y6}) R60.1
NetIC4_13: IC4.13(~{Y5}) R59.1
NetIC4_14: IC4.14(~{Y4}) R58.1
NetIC4_15: IC4.15(~{Y3}) R57.1
NetIC4_16: IC4.16(~{Y2}) R56.1
NetIC4_17: IC4.17(~{Y1}) R55.1
NetIC4_18: IC4.18(~{Y0}) R54.1
NetJ9_2: R40.1 R44.2 ; port FDC1_CONN
NetJ10_2: R41.1 R45.2 ; port FDC2_CONN
NetJ11_2: R42.1 R46.2 ; port FDC3_CONN
NetJ12_2: R43.1 R47.2 ; port FDC4_CONN
NetJ13_2: R48.1 R52.2 ; port FDC5_CONN
NetJ14_2: R49.1 R53.2 ; port FDC6_CONN
NetJ15_2: R50.1 R94.2 ; port FDC7_CONN
NetJ16_2: R51.1 R95.2 ; port FDC8_CONN
NetJ101_13: R60.2 ; port M4_OPEN
NetJ101_15: R61.2 ; port M4_CLOSE
NetJ101_32: R58.2 ; port M3_OPEN
NetJ102_11: R57.2 ; port M2_CLOSE
NetJ102_13: R56.2 ; port M2_OPEN
NetJ102_15: R55.2 ; port M1_CLOSE
NetJ102_34: R54.2 ; port M1_OPEN
NetJ102_37: R59.2 ; port M3_CLOSE

### Notes on the sheet
- 3T = 30ms
- Fin de cource : 74HC7540D
- MS1-SEQ
- Paul Miailhe

### Library data of the parts
C16-C23 = CMP-2006-02459-1: Manufacturer: Murata; Description: 0603 1 uF 25 V ±10% Tolerance X5R SMT Multilayer Ceramic Capacitor; Material: Ceramic; Tolerance: 10%; Voltage Rating: 25V; Dielectric: X5R; Part Number: GRM188R61E105KA12D; Supplier 1: Farnell; Supplier Part Number 1: 1828802; Manufacturer Part Number: GRM188R61E105KA12D; RoHS: Yes; Category: Ceramic Capacitors; Pricing 1: 10=0.13400, 100=0.05920, 500=0.03800, 1000=0.03090 (GBP); Mount: Surface Mount; Case/Package: 0603; Number of Pins: 2; Case Code (Metric): 1608; Case Code (Imperial): 0603; Min Operating Temperature: -55°C; Max Operating Temperature: 85°C; Packaging: Tape and Reel; Package Quantity: 4000; Voltage Rating (DC): 25V; Termination: SMD/SMT; Voltage: 25V; Length: 1.6mm; Width: 0.031inch; Height: 0.8mm; Depth: 0.8mm; Thickness: 0.035inch; Radiation Hardening: No; RoHS Compliant: Yes; REACH SVHC: No SVHC; Lead Free: Lead Free
C24 = CMP-08246-002186-1: Cap Ceramic 100nF 25V X7R 10% Pad SMD 0603 +125°C Automotive T/R; Manufacturer: TDK; Composition: Ceramic; Dielectric: X7R; Ratings: AEC-Q200; Length: 1.6mm; REACH SVHC: No SVHC; Width: 0.031inch; Packaging: Tape and Reel; Case/Package: 0603; Height: 0.8mm; Termination: SMD/SMT; Max Operating Temperature: 125°C; Thickness: 0.035inch; Case Code (Metric): 1608; Lead Free: Lead Free; Mount: Surface Mount; Voltage Rating: 25V; Tolerance: 10%; Weight: 7.1E-05oz; Min Operating Temperature: -55°C; Package Quantity: 1; Depth: 0.8mm; Case Code (Imperial): 0603; Supplier 1: Mouser; Supplier Part Number 1: 810-CGA3E2X7R1E104K; Manufacturer Part Number: CGA3E2X7R1E104K080AA; RoHS: Yes; Category: Ceramic Capacitors; Stock 1: 488891; Pricing 1: 1=0,12000, 10=0,05600, 50=0,05600, 100=0,02500, 1000=0,01400, 10000=0,01000 (USD); Series: CGA; Resistor Type: Ceramic; RoHS Compliant: Yes; ComponentLink1URL: https://datasheet.ciiva.com/24220/cga3e2x7r1e104k080aa-265934-24220022.pdf?src-supplier=Mouser; ComponentLink1Description: https://datasheet.ciiva.com/24220/cga3e2x7r1e104k080aa-265934-24220022.pdf?src-supplier=Mouser; ComponentLink2URL: https://datasheet.ciiva.com/22725/1735392-22725638.pdf?src-supplier=Element14; ComponentLink2Description: https://datasheet.ciiva.com/22725/1735392-22725638.pdf?src-supplier=Element14; ComponentLink3URL: https://datasheet.ciiva.com/22725/1735392-22725639.pdf?src-supplier=Element14; ComponentLink3Description: https://datasheet.ciiva.com/22725/1735392-22725639.pdf?src-supplier=Element14; ComponentLink4URL: https://datasheet.ciiva.com/16427/mlccspec-automotive-general-midvoltage-en-16427320.pdf?src-supplier=Future+Electronics; ComponentLink4Description: https://datasheet.ciiva.com/16427/mlccspec-automotive-general-midvoltage-en-16427320.pdf?src-supplier=Future+Electronics; ComponentLink5URL: https://datasheet.ciiva.com/23803/1735392-23803082.pdf?src-supplier=Newark; ComponentLink5Description: https://datasheet.ciiva.com/23803/1735392-23803082.pdf?src-supplier=Newark
IC4 = 74HC7540D,112: Integrated Circuit; Manufacturer_Name: Nexperia; Datasheet Link: https://assets.nexperia.com/documents/data-sheet/74HC_HCT7540.pdf; Height: 2.65mm; Manufacturer_Part_Number: 74HC7540D,112; Mouser Part Number: 771-HC7540D112; Mouser Price/Stock: https://www.mouser.co.uk/ProductDetail/Nexperia/74HC7540D112?qs=P62ublwmbi92dGW19WIHEQ%3D%3D; Arrow Part Number: 74HC7540D,112; Arrow Price/Stock: https://www.arrow.com/en/products/74hc7540d112/nexperia
R40-R53 R94 R95 = CMP-1012-00623-3: Chip Resistor, 10 KOhm, +/- 1%, 0.1 W, -55 to 155 degC, 0603 (1608 Metric), RoHS, Tape and Reel; Manufacturer: Panasonic; Manufacturer Part Number: ERJ-3EKF1002V; Voltage Rating: 75V; Case\/Package: 0603; Power Rating: 100mW; Temperature Coefficient: 100ppm\/degreesC; Number of Pins: 2; Package Reference: 603; Depth: 0.8mm; Mount: SurfaceMount; Package Description: 2-Pin Surface Mount Device, Body 1.6 x 0.85 mm; Datasheet Version: 02/2017; Length: 1.6mm; Lead Free: LeadFree; Height: 0.45mm; Number of Terminations: 2; Max Power Dissipation: 100mW; Min Operating Temperature: -55degC; Datasheet URL: https://industrial.panasonic.com/cdbs/www-data/pdf/RDA0000/AOA0000C304.pdf; Termination: SMD/SMT; Case Code (Metric): 1608; Tolerance: 1%; Max Operating Temperature: 155degC; RoHSCompliant: true; Voltage Rating (DC): 75V; Radiation Hardening: No; Packaging: TapeandReel; Composition: ThickFilm; Mounting Technology: SurfaceMount; Manufacturer URL: http://www.panasonic.com/; Width: 0.031inch; REACH SVHC: NoSVHC; Contact Plating: Tin; Military Standard: Not; Package Quantity: 1; Supplier 1: Mouser; Supplier Part Number 1: 667-ERJ-3EKF1002V; RoHS: Yes; Category: Chip SMD Resistors; Stock 1: 20455; Pricing 1: 1=0,10000, 10=0,04000, 50=0,04000, 100=0,01700, 1000=0,00700, 5000=0,00500, 10000=0,00500 (USD); Case/Package: 0603; Size Code: 0603; Resistor Type: Thick Film; Series: ERJ; Resistance Tolerance: 1%; Construction: Rectangular; Features: Automotive AEC-Q200; Technology: THICK FILM; RoHS Compliant: Yes; ComponentLink1URL: https://datasheet.ciiva.com/16511/aoa0000ce2-16511861.pdf?src-supplier=Avnet+Asia; ComponentLink1Description: https://datasheet.ciiva.com/16511/aoa0000ce2-16511861.pdf?src-supplier=Avnet+Asia; ComponentLink2URL: https://datasheet.ciiva.com/46372/1678782-46372725.pdf?src-supplier=Element14; ComponentLink2Description: https://datasheet.ciiva.com/46372/1678782-46372725.pdf?src-supplier=Element14; ComponentLink3URL: https://datasheet.ciiva.com/28514/426256-28514198.pdf?src-supplier=Element14; ComponentLink3Description: https://datasheet.ciiva.com/28514/426256-28514198.pdf?src-supplier=Element14; ComponentLink4URL: https://datasheet.ciiva.com/9194/aoa0000ce2-9194199.pdf?src-supplier=Avnet; ComponentLink4Description: https://datasheet.ciiva.com/9194/aoa0000ce2-9194199.pdf?src-supplier=Avnet; ComponentLink5URL: https://datasheet.ciiva.com/7830/aoa0000ce2-7830729.pdf?src-supplier=Element14; ComponentLink5Description: https://datasheet.ciiva.com/7830/aoa0000ce2-7830729.pdf?src-supplier=Element14; ComponentLink6URL: https://datasheet.ciiva.com/17212/aoa0000ce2-17212105.pdf?src-supplier=Avnet+Europe; ComponentLink6Description: https://datasheet.ciiva.com/17212/aoa0000ce2-17212105.pdf?src-supplier=Avnet+Europe; ComponentLink7URL: https://datasheet.ciiva.com/30208/aoa0000ce2-30208985.pdf?src-supplier=Onlinecomponents.com; ComponentLink7Description: https://datasheet.ciiva.com/30208/aoa0000ce2-30208985.pdf?src-supplier=Onlinecomponents.com; ComponentLink8URL: https://datasheet.ciiva.com/48530/aoa0000ce2-48530988.pdf?src-supplier=Avnet; ComponentLink8Description: https://datasheet.ciiva.com/48530/aoa0000ce2-48530988.pdf?src-supplier=Avnet; ComponentLink9URL: https://datasheet.ciiva.com/24070/aoa0000ce2-24070318.pdf?src-supplier=Mouser; ComponentLink9Description: https://datasheet.ciiva.com/24070/aoa0000ce2-24070318.pdf?src-supplier=Mouser; ComponentLink10URL: https://datasheet.ciiva.com/16759/70260748-16759807.pdf?src-supplier=Allied+Electronics; ComponentLink10Description: https://datasheet.ciiva.com/16759/70260748-16759807.pdf?src-supplier=Allied+Electronics
R54-R61 = CMP-2100-03667-1: Chip Resistor, 0 Ohm, +/- 5%, 0.1 W, -55 to 155 degC, 0603 (1608 Metric), RoHS, Tape and Reel; Manufacturer: Yageo; Temperature Coefficient: 200ppm/degreesC; Voltage Rating: 50V; Power Rating: 100mW; Resistance: 0mOhm; Width: 0.8mm; Max Operating Temperature: 155degC; Tolerance: 5%; Package Reference: 0603; Height: 0.45mm; Depth: 0.8mm; Package Description: 2-Pin Surface Mount Device, Body 1.6 x 0.8 mm; Termination: SMD/SMT; Package Quantity: 5000; Case/Package: 0603; Case Code (Imperial): 0603; Radiation Hardening: No; Number of Pins: 2; Length: 1.6mm; Lead Free: LeadFree; Voltage Rating (DC): 50V; Military Standard: Not; Datasheet URL: http://www.yageo.com/NewPortal/yageodocoutput?fileName=/pdf/R-Chip/PYu-RC_Group_51_RoHS_L_5.pdf; Manufacturer URL: http://www.yageo.com/; Packaging: TapeandReel; Case Code (Metric): 1608; Min Operating Temperature: -55degC; Composition: ThickFilm; RoHSCompliant: true; Contact Plating: Tin; Datasheet Version: Rev. 5, 10/2016; REACH SVHC: NoSVHC